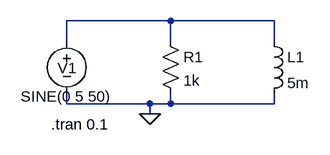
[diagram p0: schematic RL Parallel Circuit.asc]
RL Parallel Circuit.asc, the LTspice schematic file:
Version 4
SHEET 1 880 680
WIRE 240 112 80 112
WIRE 400 112 240 112
WIRE 80 144 80 112
WIRE 240 144 240 112
WIRE 400 144 400 112
WIRE 80 240 80 224
WIRE 208 240 80 240
WIRE 240 240 240 224
WIRE 240 240 208 240
WIRE 400 240 400 224
WIRE 400 240 240 240
WIRE 208 256 208 240
FLAG 208 256 0
SYMBOL res 224 128 R0
SYMATTR InstName R1
SYMATTR Value 1k
SYMBOL ind 384 128 R0
SYMATTR InstName L1
SYMATTR Value 5m
SYMBOL voltage 80 128 R0
WINDOW 0 -14 57 Left 2
WINDOW 3 -71 101 Left 2
WINDOW 123 0 0 Left 0
WINDOW 39 0 0 Left 0
SYMATTR InstName V1
SYMATTR Value SINE(0 5 50)
TEXT 56 272 Left 2 !.tran 0.1

The netlist it stands for:
* RL Parallel Circuit.asc
R1 N001 0 1k
L1 N001 0 5m
V1 N001 0 SINE(0 5 50)
.tran 0.1
.backanno
.end